# Altium schematic sheet M30517_TX_V1.0.SchDoc
size A4
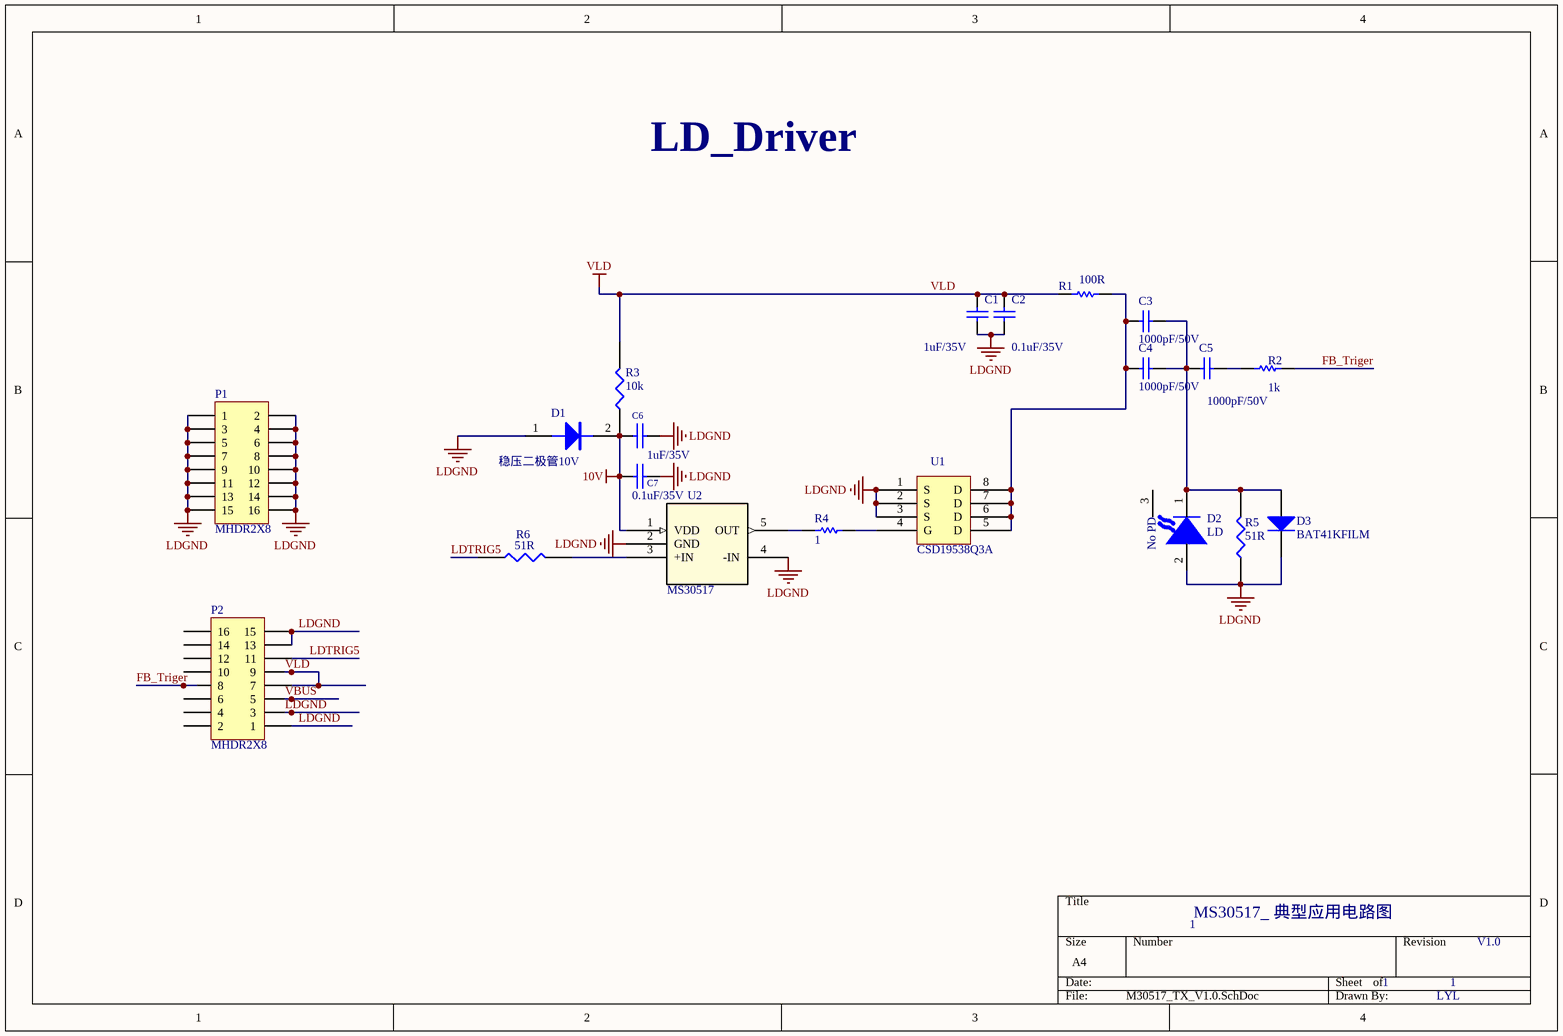
[diagram p0: M30517_TX_V1.0.SchDoc]

## Parts
C1  value 1uF/35V  [C 0603_L]  (hidden comment: 0603X105K500CT)
C2  value 0.1uF/35V  [C 0603_L]  (hidden comment: 0603X105K500CT)
C3  value 1000pF/50V  [C 0603_L]  (hidden comment: C0402C331J1GACAUTO)
C4  value 1000pF/50V  [C 0603_L]
C5  value 1000pF/50V  [C 0603_L]
C6  value 1uF/35V  [C 0603_L]  (hidden comment: GRM155R71H102KA01D)
C7  value 0.1uF/35V  [C 0603_L]  (hidden comment: (*)GCM155R71H104KE02D)
D1  稳压二极管10V  [SOD-323]
D2  LD  [LD1]
D3  BAT41KFILM  [SOD-523]
P1  MHDR2X8  [HDR2.54-M-LS-2x8P]
P2  MHDR2X8  [HDR2.54-M-LS-2x8P]
R1  100R  [0603R]
R2  value 1k  [0603R]  (hidden comment: RC0402FR-7W1KL)
R3  10k  [0603R]
R4  value 1  [0603R]  (hidden comment: CR0402F10RQ10)
R5  51R  [0603R]
R6  51R  [0603R]
U1  CSD19538Q3A  [QA3]
U2  MS30517  [SOT23-5]

## Nets
10V: C6.2 C7.2 D1.2(K) R3.1 U2.1(VDD)
LDGND: C1.2 C2.2 C6.1 C7.1 D1.1(A) D2.2 D3.2(K) P1.1 P1.2 P1.3 P1.4 P1.5 P1.6 P1.7 P1.8 P1.9 P1.10 P1.11 P1.12 P1.13 P1.14 P1.15 P1.16 P2.1 P2.3 P2.13 P2.15 R5.1 U1.1(S) U1.2(S) U1.3(S) U2.2(GND) U2.4(-IN)
VLD: C1.1 C2.1 P2.7 P2.9 R1.2 R3.2
FB_Triger: P2.8 R2.1
LDTRIG5: P2.11 R6.1
VBUS: P2.5
NetC3_1: C3.1 C4.1 R1.1 U1.5(D) U1.6(D) U1.7(D) U1.8(D)
NetC3_2: C3.2 C4.2 C5.1 D2.1 D3.1(A) R5.2
NetC5_2: C5.2 R2.2
NetR4_1: R4.1 U1.4(G)
NetR4_2: R4.2 U2.5(OUT)
NetR6_2: R6.2 U2.3(+IN)

Not connected (* = marked no-connect by the designer): D2 3; P2 2 4 6 10 12 14 16

## Notes on the sheet
- LD_Driver
- MS30517_ 典型应用电路图
- 1
- V1.0
- LYL
- (in symbol LD_Cathode_NOPD) No PD

## Library data of the parts
C1 C2 = Cap: Walsin - 1uF, 50V, X5R, 10%; Published: 8-Jun-2000; LatestRevisionDate: 17-Jul-2002; LatestRevisionNote: Re-released for DXP Platform.; PackageReference: RAD-0.3; Publisher: Altium Limited; PackageDescription: Radial Cap, Thru-Hole; 2 Leads; 0.3 in Pin Spacing
C3 C5 = Cap: 1000pF,  0402 ,50V, NP0, 2%; Published: 8-Jun-2000; LatestRevisionDate: 17-Jul-2002; LatestRevisionNote: Re-released for DXP Platform.; PackageReference: RAD-0.3; Publisher: Altium Limited; PackageDescription: Radial Cap, Thru-Hole; 2 Leads; 0.3 in Pin Spacing
C4 = Cap: 1000pF,  0402 ,50V, NP0, 5%; Published: 8-Jun-2000; LatestRevisionDate: 17-Jul-2002; LatestRevisionNote: Re-released for DXP Platform.; PackageReference: RAD-0.3; Publisher: Altium Limited; PackageDescription: Radial Cap, Thru-Hole; 2 Leads; 0.3 in Pin Spacing
C6 = CAP: Murata - 1nF, 50V, X7R, 10%
C7 = CAP: Murata - 0.1uF, 50V, X7R, 10%
D1 = DIODE: Value: CMDZ10L
D2 = LD_Cathode_NOPD: Laser
D3 = Diode: STM - Sckottky, 200mA, 100 V; Published: 8-Jun-2000; LatestRevisionDate: 17-Jul-2002; LatestRevisionNote: Re-released for DXP Platform.; PackageVersion: Sep-1996; PackageReference: SMC; Publisher: Altium Limited; PackageDescription: DO-214-AB/SMC; 2 C-Bend Leads; Body 7.9 x 5.9 mm, inc. leads (LxW); Code_JEDEC: DO-214-AB; Value: BAT41KFILM
P1 P2 = MHDR2X8: Header, 8-Pin, Dual row; LatestRevisionDate: 17-Jul-2002; LatestRevisionNote: Re-released for DXP Platform.; Publisher: Altium Limited
R1 R2 = Res1: Yageo - 1K, 1/8W, 1 %; Published: 8-Jun-2000; LatestRevisionDate: 17-Jul-2002; LatestRevisionNote: Re-released for DXP Platform.; PackageReference: AXIAL-0.3; Publisher: Altium Limited; PackageDescription: Axial Device, Thru-Hole; 2 Leads; 0.3 in Pin Spacing
  R1: Value: 100R
R3 R5 R6 = RES1
R4 = Res1: 10ohm, 0402,1/16W, 1 %; Published: 8-Jun-2000; LatestRevisionDate: 17-Jul-2002; LatestRevisionNote: Re-released for DXP Platform.; PackageReference: AXIAL-0.3; Publisher: Altium Limited; PackageDescription: Axial Device, Thru-Hole; 2 Leads; 0.3 in Pin Spacing
U1 = N_MOSFET
U2 = UC27517A: UCC27157; Manufacturer_Part_Number: MCP9501PT-115E/OT; Vendor: Microchip; Built_By: EMA_Jessica; SourceLibrary: Microchip_2019-08-23_21; Copyright: Copyright (C) 2018 Accelerated Designs. All rights reserved; RefDes: RefDes; Type: DEV